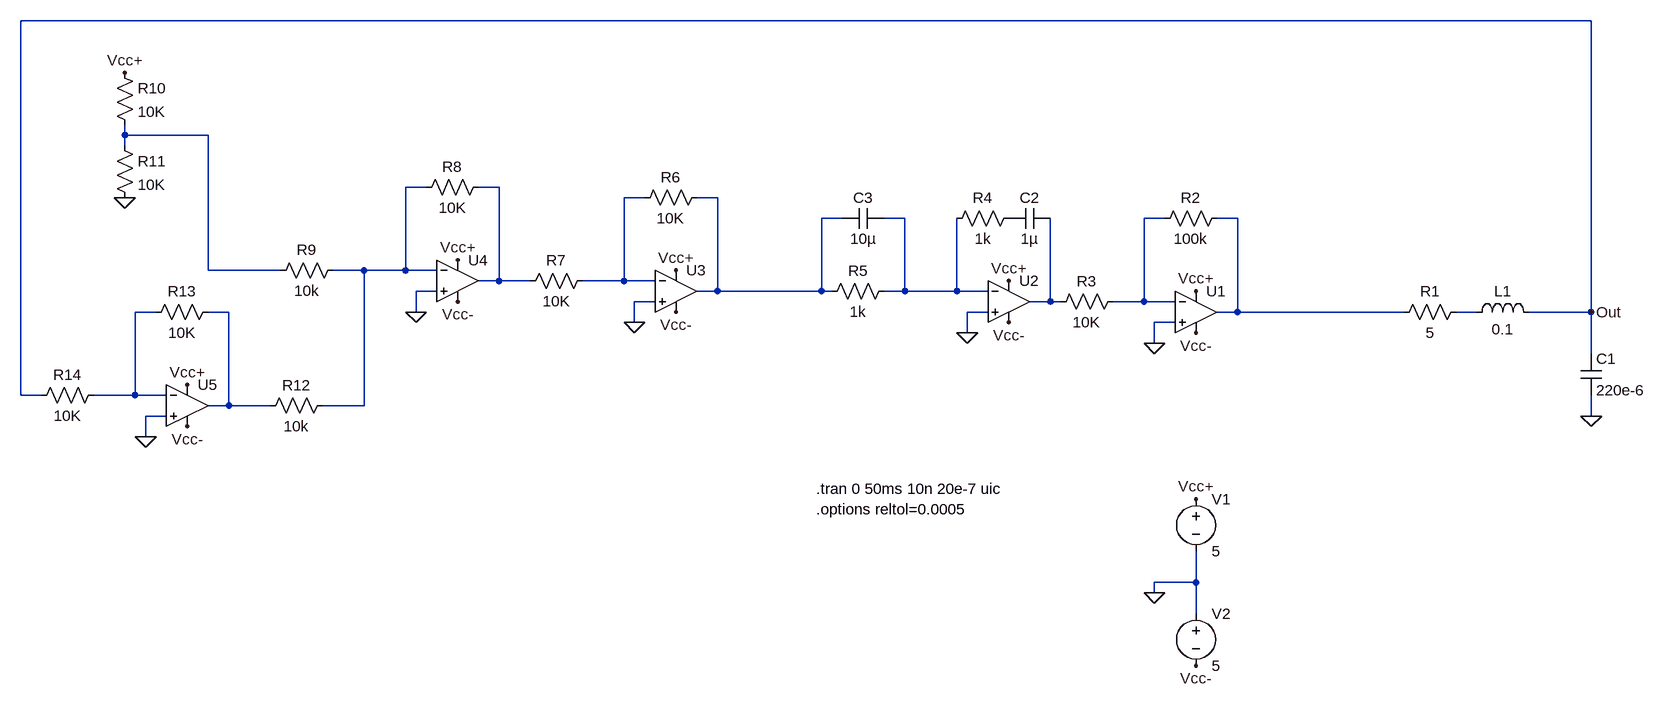
[diagram p0: schematic controlador_PID.asc]
controlador_PID.asc, the LTspice schematic file:
Version 4.1
SHEET 1 1332 688
WIRE 1056 -400 -1360 -400
WIRE -1200 -224 -1200 -240
WIRE -1072 -224 -1200 -224
WIRE -1200 -208 -1200 -224
WIRE -736 -144 -768 -144
WIRE -624 -144 -656 -144
WIRE -400 -128 -432 -128
WIRE -288 -128 -320 -128
WIRE -96 -96 -128 -96
WIRE 0 -96 -32 -96
WIRE 400 -96 368 -96
WIRE 512 -96 480 -96
WIRE -1072 -16 -1072 -224
WIRE -960 -16 -1072 -16
WIRE -832 -16 -880 -16
WIRE -768 -16 -768 -144
WIRE -768 -16 -832 -16
WIRE -720 -16 -768 -16
WIRE -624 0 -624 -144
WIRE -624 0 -656 0
WIRE -576 0 -624 0
WIRE -432 0 -432 -128
WIRE -432 0 -496 0
WIRE -384 0 -432 0
WIRE -720 16 -752 16
WIRE -288 16 -288 -128
WIRE -288 16 -320 16
WIRE -128 16 -128 -96
WIRE -128 16 -288 16
WIRE -112 16 -128 16
WIRE 0 16 0 -96
WIRE 0 16 -32 16
WIRE 80 16 80 -96
WIRE 80 16 0 16
WIRE 128 16 80 16
WIRE -384 32 -416 32
WIRE 224 32 224 -96
WIRE 224 32 192 32
WIRE 240 32 224 32
WIRE 368 32 368 -96
WIRE 368 32 320 32
WIRE 416 32 368 32
WIRE -1152 48 -1184 48
WIRE -1040 48 -1072 48
WIRE -752 48 -752 16
WIRE 128 48 96 48
WIRE 512 48 512 -96
WIRE 512 48 480 48
WIRE 768 48 512 48
WIRE 880 48 848 48
WIRE 1056 48 1056 -400
WIRE 1056 48 960 48
WIRE -416 64 -416 32
WIRE 416 64 384 64
WIRE 96 80 96 48
WIRE 384 96 384 64
WIRE 1056 112 1056 48
WIRE -1360 176 -1360 -400
WIRE -1328 176 -1360 176
WIRE -1184 176 -1184 48
WIRE -1184 176 -1248 176
WIRE -1136 176 -1184 176
WIRE -1040 192 -1040 48
WIRE -1040 192 -1072 192
WIRE -976 192 -1040 192
WIRE -832 192 -832 -16
WIRE -832 192 -896 192
WIRE -1136 208 -1168 208
WIRE 1056 208 1056 176
WIRE -1168 240 -1168 208
WIRE 448 464 448 416
WIRE 448 464 384 464
WIRE 384 480 384 464
WIRE 448 512 448 464
FLAG 1056 208 0
FLAG 384 96 0
FLAG 384 480 0
FLAG 448 336 Vcc+
FLAG 448 592 Vcc-
FLAG 96 80 0
FLAG -416 64 0
FLAG -752 48 0
FLAG -1168 240 0
FLAG -1200 -128 0
FLAG -1200 -320 Vcc+
FLAG -1104 160 Vcc+
FLAG -688 -32 Vcc+
FLAG -352 -16 Vcc+
FLAG 160 0 Vcc+
FLAG 448 16 Vcc+
FLAG 448 80 Vcc-
FLAG 160 64 Vcc-
FLAG -352 48 Vcc-
FLAG -688 32 Vcc-
FLAG -1104 224 Vcc-
FLAG 1056 48 Out
SYMBOL res 864 32 R90
WINDOW 0 0 56 VBottom 2
WINDOW 3 32 56 VTop 2
SYMATTR InstName R1
SYMATTR Value 5
SYMBOL ind 976 64 M270
WINDOW 0 32 56 VTop 2
WINDOW 3 5 56 VBottom 2
SYMATTR InstName L1
SYMATTR Value 0.1
SYMBOL cap 1040 112 R0
SYMATTR InstName C1
SYMATTR Value 220e-6
SYMBOL OpAmps\\UniversalOpAmp2 448 48 R0
SYMATTR InstName U1
SYMBOL res 496 -112 R90
WINDOW 0 0 56 VBottom 2
WINDOW 3 32 56 VTop 2
SYMATTR InstName R2
SYMATTR Value 100k
SYMBOL res 336 16 R90
WINDOW 0 0 56 VBottom 2
WINDOW 3 32 56 VTop 2
SYMATTR InstName R3
SYMATTR Value 10K
SYMBOL voltage 448 320 R0
SYMATTR InstName V1
SYMATTR Value 5
SYMBOL voltage 448 496 R0
SYMATTR InstName V2
SYMATTR Value 5
SYMBOL OpAmps\\UniversalOpAmp2 160 32 R0
SYMATTR InstName U2
SYMBOL cap 224 -112 R90
WINDOW 0 0 32 VBottom 2
WINDOW 3 32 32 VTop 2
SYMATTR InstName C2
SYMATTR Value 1µ
SYMBOL res 176 -112 R90
WINDOW 0 0 56 VBottom 2
WINDOW 3 32 56 VTop 2
SYMATTR InstName R4
SYMATTR Value 1k
SYMBOL res -16 0 R90
WINDOW 0 0 56 VBottom 2
WINDOW 3 32 56 VTop 2
SYMATTR InstName R5
SYMATTR Value 1k
SYMBOL cap -32 -112 R90
WINDOW 0 0 32 VBottom 2
WINDOW 3 32 32 VTop 2
SYMATTR InstName C3
SYMATTR Value 10µ
SYMBOL OpAmps\\UniversalOpAmp2 -352 16 R0
SYMATTR InstName U3
SYMBOL res -304 -144 R90
WINDOW 0 0 56 VBottom 2
WINDOW 3 32 56 VTop 2
SYMATTR InstName R6
SYMATTR Value 10K
SYMBOL res -480 -16 R90
WINDOW 0 0 56 VBottom 2
WINDOW 3 32 56 VTop 2
SYMATTR InstName R7
SYMATTR Value 10K
SYMBOL OpAmps\\UniversalOpAmp2 -688 0 R0
SYMATTR InstName U4
SYMBOL res -640 -160 R90
WINDOW 0 0 56 VBottom 2
WINDOW 3 32 56 VTop 2
SYMATTR InstName R8
SYMATTR Value 10K
SYMBOL res -864 -32 R90
WINDOW 0 0 56 VBottom 2
WINDOW 3 32 56 VTop 2
SYMATTR InstName R9
SYMATTR Value 10k
SYMBOL res -1216 -336 R0
SYMATTR InstName R10
SYMATTR Value 10K
SYMBOL res -1216 -224 R0
SYMATTR InstName R11
SYMATTR Value 10K
SYMBOL res -880 176 R90
WINDOW 0 0 56 VBottom 2
WINDOW 3 32 56 VTop 2
SYMATTR InstName R12
SYMATTR Value 10k
SYMBOL OpAmps\\UniversalOpAmp2 -1104 192 R0
SYMATTR InstName U5
SYMBOL res -1056 32 R90
WINDOW 0 0 56 VBottom 2
WINDOW 3 32 56 VTop 2
SYMATTR InstName R13
SYMATTR Value 10K
SYMBOL res -1232 160 R90
WINDOW 0 0 56 VBottom 2
WINDOW 3 32 56 VTop 2
SYMATTR InstName R14
SYMATTR Value 10K
TEXT -136 320 Left 2 !.tran 0 50ms 10n 20e-7 uic\n.options reltol=0.0005

The netlist it stands for:
* controlador_PID.asc
R1 N012 N008 5
L1 Out N012 0.1
C1 Out 0 220e-6
X§U1 0 N007 Vcc+ Vcc- N008 level2 Avol=1Meg GBW=10Meg Slew=10Meg Ilimit=25m Rail=0 Vos=0 En=0 Enk=0 In=0 Ink=0 Rin=500Meg  ; pins In+ In- V+ V- OUT
R2 N008 N007 100k
R3 N007 N009 10K
V1 Vcc+ 0 5
V2 0 Vcc- 5
X§U2 0 N006 Vcc+ Vcc- N009 level2 Avol=1Meg GBW=10Meg Slew=10Meg Ilimit=25m Rail=0 Vos=0 En=0 Enk=0 In=0 Ink=0 Rin=500Meg  ; pins In+ In- V+ V- OUT
C2 N009 P001 1µ
R4 P001 N006 1k
R5 N006 N005 1k
C3 N006 N005 10µ
X§U3 0 N004 Vcc+ Vcc- N005 level2 Avol=1Meg GBW=10Meg Slew=10Meg Ilimit=25m Rail=0 Vos=0 En=0 Enk=0 In=0 Ink=0 Rin=500Meg  ; pins In+ In- V+ V- OUT
R6 N005 N004 10K
R7 N004 N003 10K
X§U4 0 N002 Vcc+ Vcc- N003 level2 Avol=1Meg GBW=10Meg Slew=10Meg Ilimit=25m Rail=0 Vos=0 En=0 Enk=0 In=0 Ink=0 Rin=500Meg  ; pins In+ In- V+ V- OUT
R8 N003 N002 10K
R9 N002 N001 10k
R10 Vcc+ N001 10K
R11 N001 0 10K
R12 N002 N011 10k
X§U5 0 N010 Vcc+ Vcc- N011 level2 Avol=1Meg GBW=10Meg Slew=10Meg Ilimit=25m Rail=0 Vos=0 En=0 Enk=0 In=0 Ink=0 Rin=500Meg  ; pins In+ In- V+ V- OUT
R13 N011 N010 10K
R14 N010 Out 10K
.tran 0 50ms 10n 20e-7 uic
.options reltol=0.0005
.lib UniversalOpAmp2.lib
.backanno
.end